# Altium schematic sheet USBInterface.SchDoc: fNIRS - USB Interface
size A4; CompanyName: UofT Capstone Team 2024991; DrawnBy: Tony Kim; Revision: 1; SheetNumber: 6; SheetTotal: 13
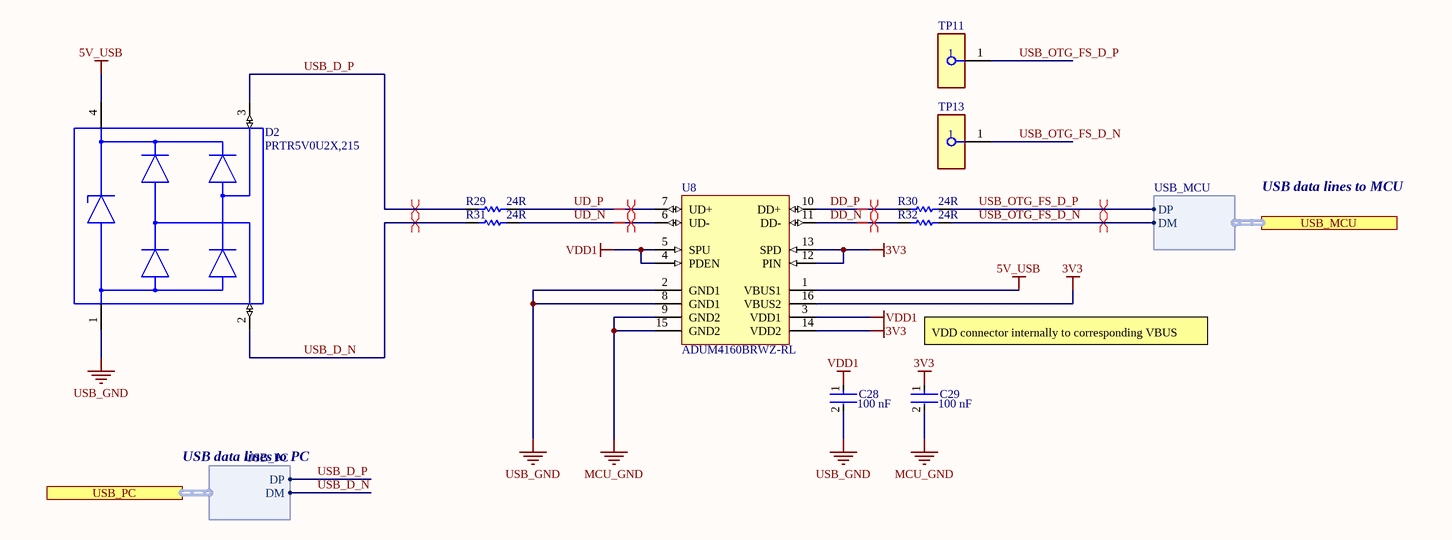
[diagram p0: USBInterface.SchDoc]

## Parts
C28  Capacitance: 100 nF  [FP-CC0603-DA-MFG]  (hidden comment: CC0603KRX7R7BB104)
C29  Capacitance: 100 nF  [FP-CC0603-DA-MFG]  (hidden comment: CC0603KRX7R7BB104)
D2  PRTR5V0U2X,215  [FP-SOT143B-MFG]
R29  Resistance: 24R  [RESC1608X55X30ML15T15]  (hidden comment: ERJ-3EKF24R0V)
R30  Resistance: 24R  [RESC1608X55X30ML15T15]  (hidden comment: ERJ-3EKF24R0V)
R31  Resistance: 24R  [RESC1608X55X30ML15T15]  (hidden comment: ERJ-3EKF24R0V)
R32  Resistance: 24R  [RESC1608X55X30ML15T15]  (hidden comment: ERJ-3EKF24R0V)
TP11  S2761-46R  [FP-S2761-46R-MFG]  (value not drawn)
TP13  S2761-46R  [FP-S2761-46R-MFG]  (value not drawn)
U8  ADUM4160BRWZ-RL  [RW-16_L]

## Ports
USB_MCU (harness USB_MCU, see MCU[2B]), USB_PC (harness USB_PC, see MCU[2B], Connectors[2C], MCU[1B])

## Harnesses
USB_MCU: DM, DP
USB_PC: DM, DP

## Nets
3V3: C29.1 U8.12(PIN) U8.13(SPD) U8.14(VDD2) U8.16(VBUS2)
5V_USB: D2.4(VCC) U8.1(VBUS1)
MCU_GND: C29.2 U8.9(GND2) U8.15(GND2)
USB_GND: C28.2 D2.1(GND) U8.2(GND1) U8.8(GND1)
VDD1: C28.1 U8.3(VDD1) U8.4(PDEN) U8.5(SPU)
DD_N: R32.1 U8.11(DD-)
DD_P: R30.1 U8.10(DD+)
UD_N: R31.2 U8.6(UD-)
UD_P: R29.2 U8.7(UD+)
USB_D_N: D2.2(I/O_1) R31.1 ; port USB_PC.DM
USB_D_P: D2.3(I/O_2) R29.1 ; port USB_PC.DP
USB_OTG_FS_D_N: R32.2 TP13.1 ; port USB_MCU.DM
USB_OTG_FS_D_P: R30.2 TP11.1 ; port USB_MCU.DP

## Layout directives
differential pair: DD_N, DD_P, UD_N, UD_P, USB_D_N, USB_D_P, USB_OTG_FS_D_N, USB_OTG_FS_D_P

## Notes on the sheet
- USB data lines to MCU
- (near C29) VDD connector internally to corresponding VBUS
- USB data lines to PC

## Library data of the parts
C28 C29 = CMP-2000-05002-2: CAP CER 0.1UF 16V X7R 0603; Manufacturer: YAGEO; Tolerance: 0.1; Value: 100 nF; Temperature Coefficient: 15%; Material: Ceramic; Voltage Rating: 16 V; Package: CC0603-DA; ComponentLink2Description: Datasheet; Octopart: https://octopart.com/cc0603krx7r7bb104-yageo-192941; Temperature Range High: +125°C; Digikey Description: CAP CER 0.1UF 16V X7R 0603; Voltage: 16 V; Device Class L2: Capacitors; Height: 0.9mm; Temperature: -55°C to +125°C; Manufacturer Part Number: CC0603KRX7R7BB104; Device Class L1: Passive Components; Device Class L3: Ceramic Capacitors; ComponentLink2URL: http://www.yageo.com/documents/recent/UPY-GPHC_X7R_6.3V-to-50V_18.pdf; Footprint Url: http://www.yageo.com/exep/pages/download/literatures/UPY-C_GEN_24.pdf; RoHS: TRUE; Temperature Range Low: -55°C; Temperature Characteristic: X7R; Lead Free: Yes; Category: Cap; Mouser Description: Multilayer Ceramic Capacitor, CC Series, 0.1 - F, - 10%, X7R, 16 V, 0603 [1608 Metric]; Automotive: No
D2 = CMP-14436-000007-1: TVS DIODE 5.5V SOT143B
R29-R32 = CMP-1012-00325-2: Manufacturer: Panasonic; Part Number: ERJ-3EKF24R0V
TP11 TP13 = CMP-15817-000011-1: PC TEST POINT NATURAL; Body Material: Brass; Plating: Tin; Material: Copper Alloy; Mount: Surface Mount; Color: Natural; Packaging: Tape and Reel; RoHS Compliant: Yes
U8 = CMP-0534-00648-1: Full/Low Speed USB Digital Isolator, 2 Channels, 5 kV rms, 3.1 to 5.5 V, -40 to 105 degC, 16-Pin SOIC (RW-16), RoHS, Reel; Manufacturer: Analog Devices; Number of Channels: 2; IDD@12 Mbps: 8 mA Max.; Data Rate: 12 Mbps Max.; CIN: 10 pF Typ.; Voltage Isolation: 5 kVrms; ComponentLink1URL: http://www.analog.com/en/index.html; ComponentLink1Description: Manufacturer URL; ComponentLink3Description: Package Specification; PartNumber: ADUM4160BRWZ-RL; Mounting Technology: Surface Mount; DatasheetVersion: Rev. D; VBUS: 3.1 to 5.5 V; Temperature Range: -40 to 105 degC; Packing: Reel; PackageVersion: Mar-07; ComponentLink3URL: http://www.analog.com/static/imported-files/packages/PKG_PDF/SOIC_WIDE%20(RW)/RW_16.pdf; PackageDescription: 16-Pin Small Outline Integrated Circuit, Body 10.3 x 7.5 mm, Pitch 1.27 mm; ComponentLink2URL: http://www.analog.com/static/imported-files/data_sheets/ADuM4160.pdf; RoHS: TRUE; ComponentLink2Description: Datasheet